# EAGLE schematic gate (EAGLE 8.2.2)
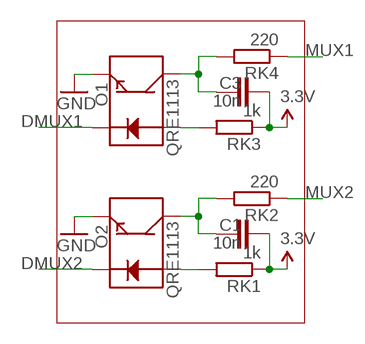
[diagram p0: schematic, sheet 1]

## Parts
C1  10n  C-EUC0805  [C0805]
C3  10n  C-EUC0805  [C0805]
O1  QRE1113  [QRE1113]
O2  QRE1113  [QRE1113]
RK1  1k  R-EU_M0805  [M0805]
RK2  220  R-EU_M0805  [M0805]
RK3  1k  R-EU_M0805  [M0805]
RK4  220  R-EU_M0805  [M0805]

## Nets
3.3V [power]: C1.2 C3.2 RK1.1 RK3.1
DMUX1: O1.2(K)
DMUX2: O2.2(K)
GND [power]: O1.4(E) O2.4(E)
MUX1: RK4.1
MUX2: RK2.1
RD1: O1.1(A) RK3.2
RD2: O2.1(A) RK1.2
Y1: C3.1 O1.3(C) RK4.2
Y2: C1.1 O2.3(C) RK2.2

## Library data of the parts
C1 C3 = rcl:C-EU: CAPACITOR, European symbol
O1 O2 = SparkFun:QRE1113
RK1-RK4 = resistor:R-EU_: RESISTOR, European symbol

## Net classes
1 power: width 0.203 mm, drill 0.305 mm, clearance 0.25 mm